# EAGLE design PowerBoard (EAGLE 8.6.3)

## Sheet 1 of 4: Input Voltage
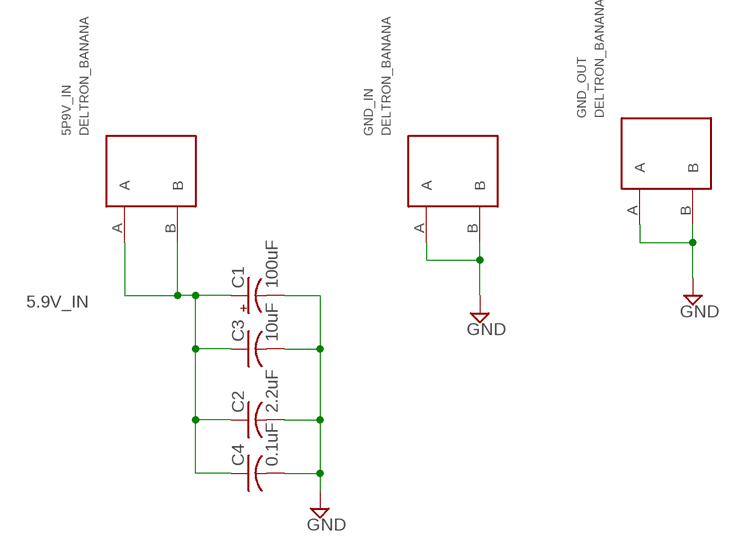
[diagram p0: schematic, sheet 1]

### Parts
5P9V_IN  DELTRON_BANANA  [DELTRON_BANANA]
C1  100uF  CAP_POL_DEV  [CAP_POL_RADIAL_8MM_3P5MMPAD]
C2  2.2uF  C-USC0603  [C0603]
C3  10uF  C-USC1206  [C1206]
C4  0.1uF  C-USC0603  [C0603]
GND_IN  DELTRON_BANANA  [DELTRON_BANANA]
GND_OUT  DELTRON_BANANA  [DELTRON_BANANA]

### Nets
5.9V_IN: 5P9V_IN.A 5P9V_IN.B C1.PIN+ C2.1 C3.1 C4.1 ; also sheet 2,3,4
GND: C1.PIN- C2.2 C3.2 C4.2 GND_IN.A GND_IN.B GND_OUT.A GND_OUT.B ; also sheet 2,3,4

## Sheet 2 of 4: -5V
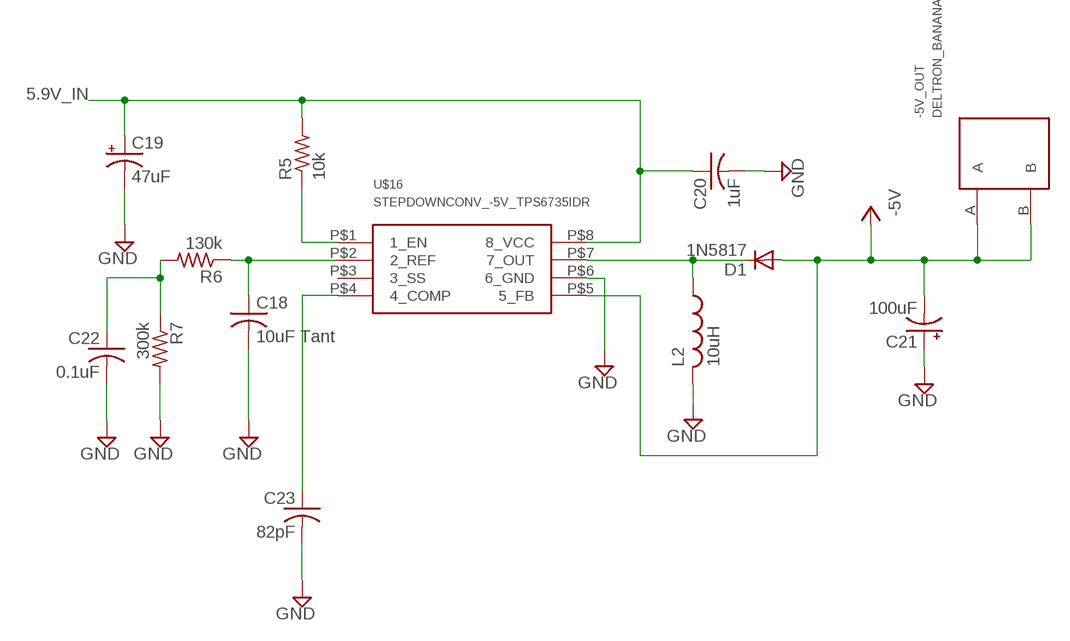
[diagram p1: schematic, sheet 2]

### Parts
-5V_OUT  DELTRON_BANANA  [DELTRON_BANANA]
C18  10uF Tant  C-USC1206  [C1206]
C19  47uF  CPOL-USE5-10.5  [E5-10,5]
C20  1uF  C-USC0603  [C0603]
C21  100uF  CPOL-USE2.5-7  [E2,5-7]
C22  0.1uF  C-USC0603  [C0603]
C23  82pF  C-USC0603  [C0603]
D1  1N5817  DIODE1N4148  [DIODE-1N4148]
L2  10uH  COILCRAFT_10UHIND_DO1608C-103MLB  [COILCRAFT_POWERIND_DO1608C-103MLB]
R5  10k  R-US_R0603  [R0603]
R6  130k  R-US_R0603  [R0603]
R7  300k  R-US_R0603  [R0603]
U$16  STEPDOWNCONV_-5V_TPS6735IDR  [SOIC8]

### Nets
5.9V_IN: C19.+ C20.1 R5.2 U$16.P$8(8_VCC) ; also sheet 1,3,4
-5V: -5V_OUT.A -5V_OUT.B C21.- D1.A U$16.P$5(5_FB)
GND: C18.2 C19.- C20.2 C21.+ C22.2 C23.2 L2.P$2 R7.2 U$16.P$6(6_GND) ; also sheet 1,3,4
N$2: D1.C L2.P$1 U$16.P$7(7_OUT)
N$5: R5.1 U$16.P$1(1_EN)
N$6: C22.1 R6.2 R7.1
N$7: C18.1 R6.1 U$16.P$2(2_REF)
N$8: C23.1 U$16.P$4(4_COMP)
Unconnected: U$16.P$3(3_SS)

## Sheet 3 of 4: 15V
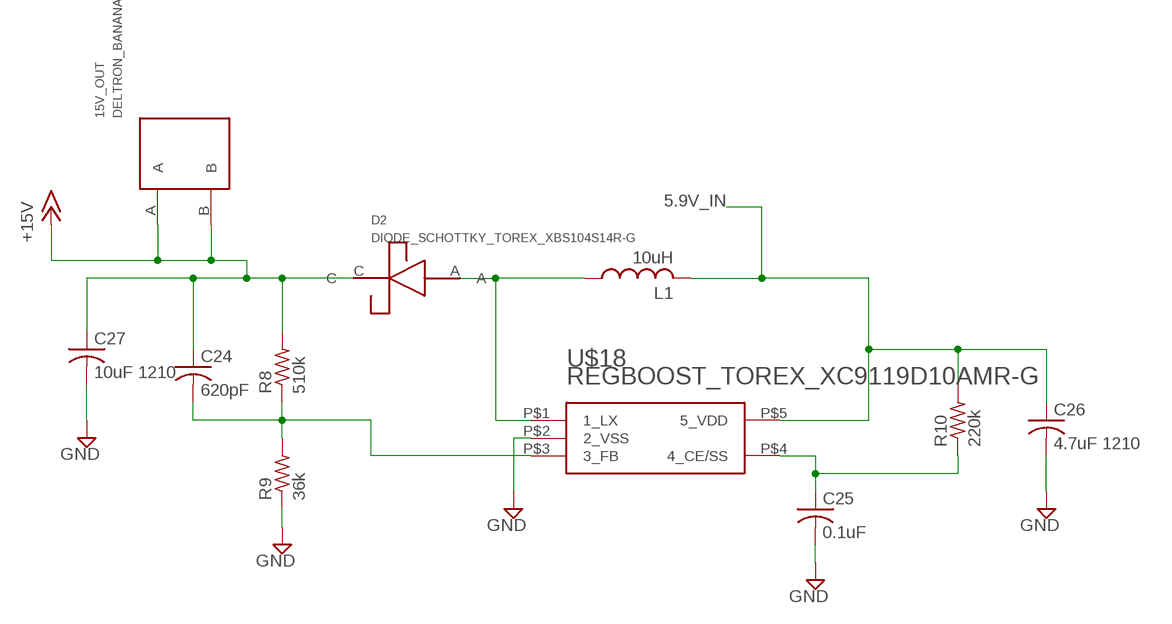
[diagram p2: schematic, sheet 3]

### Parts
15V_OUT  DELTRON_BANANA  [DELTRON_BANANA]
C24  620pF  C-USC0603  [C0603]
C25  0.1uF  C-USC0603  [C0603]
C26  4.7uF 1210  C-USC1210  [C1210]
C27  10uF 1210  C-USC1210  [C1210]
D2  DIODE_SCHOTTKY_TOREX_XBS104S14R-G  [SOD-123A]
L1  10uH  SUMIDA_10UH_IND_CDRH4D18CNP-100PC  [SUMIDA_INDUCTOR_CDRH4D18CNP-100PC]
R8  510k  R-US_R0603  [R0603]
R9  36k  R-US_R0603  [R0603]
R10  220k  R-US_R0603  [R0603]
U$18  REGBOOST_TOREX_XC9119D10AMR-G  [SOT25-5]

### Nets
5.9V_IN: C26.1 L1.P$2 R10.2 U$18.P$5(5_VDD) ; also sheet 1,2,4
+15V: 15V_OUT.A 15V_OUT.B C24.1 C27.1 D2.C R8.2
GND: C25.2 C26.2 C27.2 R9.1 U$18.P$2(2_VSS) ; also sheet 1,2,4
N$10: D2.A L1.P$1 U$18.P$1(1_LX)
N$12: C24.2 R8.1 R9.2 U$18.P$3(3_FB)
N$14: C25.1 R10.1 U$18.P$4(4_CE/SS)

## Sheet 4 of 4: 2.5V
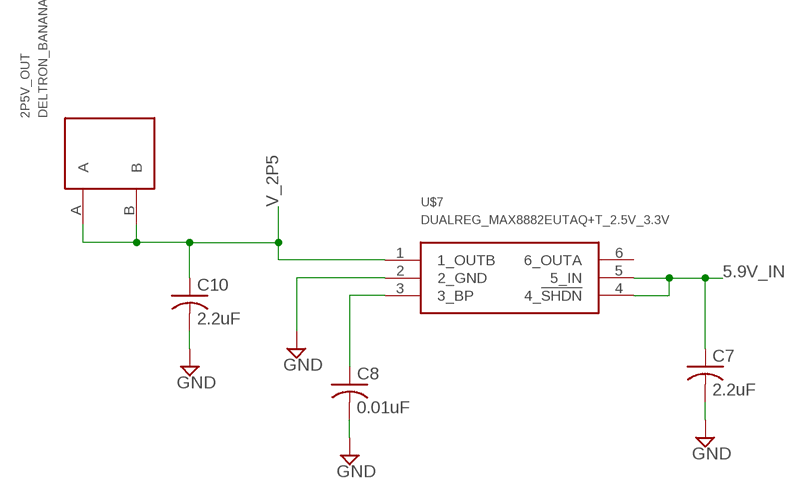
[diagram p3: schematic, sheet 4]

### Parts
2P5V_OUT  DELTRON_BANANA  [DELTRON_BANANA]
C7  2.2uF  C-USC0603  [C0603]
C8  0.01uF  C-USC0603  [C0603]
C10  2.2uF  C-USC0603  [C0603]
U$7  DUALREG_MAX8882EUTAQ+T_2.5V_3.3V  [SOT23-6]

### Nets
5.9V_IN: C7.1 U$7.4(4_!SHDN) U$7.5(5_IN) ; also sheet 1,2,3
GND: C7.2 C8.2 C10.2 U$7.2(2_GND) ; also sheet 1,2,3
N$3: C8.1 U$7.3(3_BP)
V_2P5: 2P5V_OUT.A 2P5V_OUT.B C10.1 U$7.1(1_OUTB)
Unconnected: U$7.6(6_OUTA)

## Library data of the parts
2P5V_OUT 5P9V_IN 15V_OUT -5V_OUT GND_IN GND_OUT = tic_lib_3:DELTRON_BANANA
C1 = RF_servo_SA032212:CAP_POL_DEV: Polarized Capacitor Created on : 03.24.2012 Created by: Serhan Ardanuc
C2-C4 C7 C8 C10 C18 C20 C22-C27 = rcl:C-US: CAPACITOR, American symbol
C19 C21 = rcl:CPOL-US: POLARIZED CAPACITOR, American symbol
D1 = SparkFun:DIODE: Diode These are standard reverse protection diodes and small signal diodes. SMA package can handle up to about 1A. SOD-323 can handle about 200mA. What the SOD-323 package when ordering, there are some mfgs out there that are 5-pin packages.
D2 = fp64v2lib:DIODE_SCHOTTKY_TOREX_XBS104S14R-G: Mouser part no: 865-XBS104S14R-G
L1 = fp64v2lib:SUMIDA_10UH_IND_CDRH4D18CNP-100PC: Digikey Part No: 308-1656-1-ND
L2 = fp64v2lib:COILCRAFT_10UHIND_DO1608C-103MLB: Mouser part no: 994-DO1608C-103MLB
R5-R10 = rcl:R-US_: RESISTOR, American symbol
U$7 = fp64v2lib:DUALREG_MAX8882EUTAQ+T_2.5V_3.3V: Digikey part no: MAX8882EUTAQ+TCT-ND
U$16 = fp64v2lib:STEPDOWNCONV_-5V_TPS6735IDR: Digikey: 296-10982-1-ND
U$18 = fp64v2lib:REGBOOST_TOREX_XC9119D10AMR-G: Digikey Part no: 893-1165-1-ND

## Board
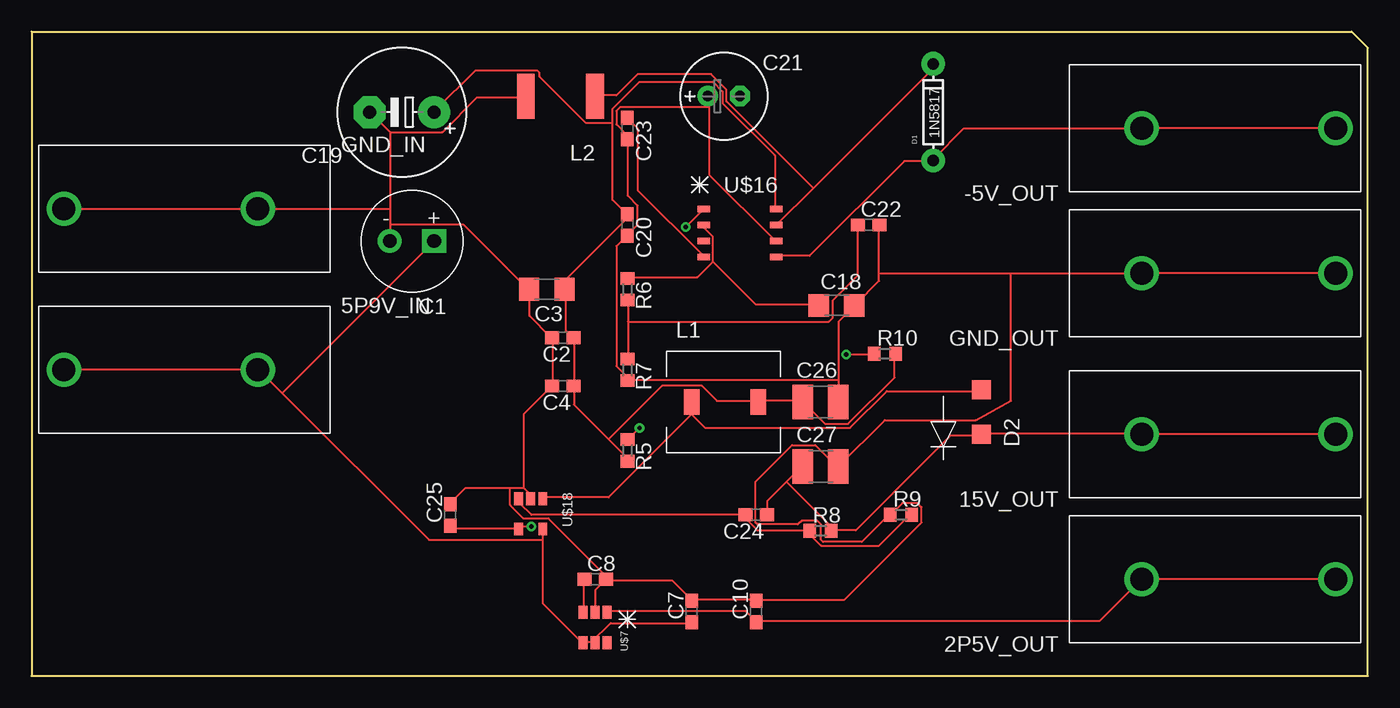
[diagram p4: board, top side]
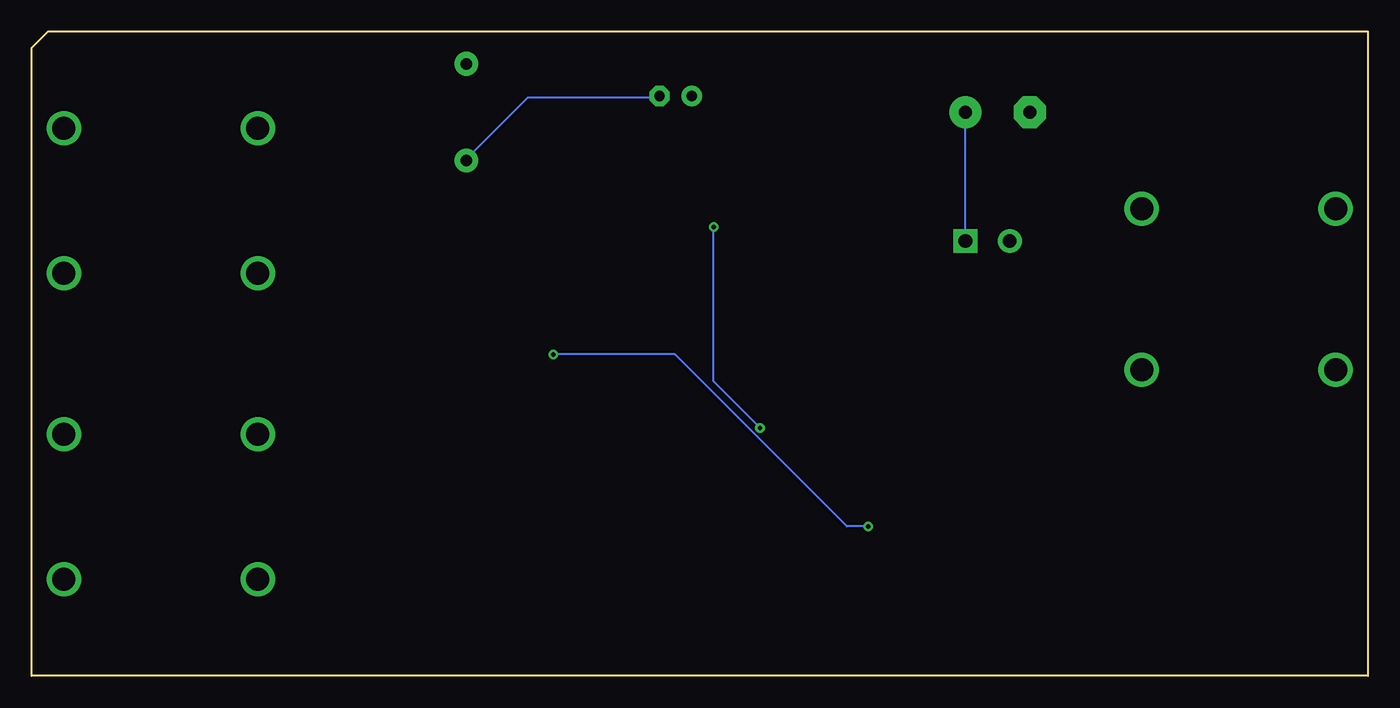
[diagram p5: board, bottom side, seen from below]

Size 105.41 x 50.8 mm. Coordinates in mm from the lower left corner, seen from the top.
Outline: 0,50.8 104.14,50.8 105.41,49.53 105.41,0 0,0 0,50.8
Copper layers (1*16): Top 0.035mm / dielectric 1.5mm / Bottom 0.035mm
Design rules "default": minimum track width 6mil, minimum drill 0.35mm, track to track 6mil, track to pad 6mil, pad to pad 6mil, via to via 6mil, smd to smd 6mil, copper to edge 40mil, drill to drill 6mil, minimum pad ring 10mil, minimum via ring 8mil, stop-mask expansion 4mil, vias tented up to drill 0mil, thermal gap 10mil

### Footprints (pad centres in the part's own frame; a part is rotated, then mirrored left to right if it is on the bottom)
DELTRON_BANANA = drill 1.8: A 0,0; B 15.3,0
CAP_POL_RADIAL_8MM_3P5MMPAD = drill 1.087 pad 1.88 square: PIN+ 0,0 | drill 1.087 pad 1.88: PIN- 3.5,0
C0603 = smd 1.1 x 1: 1 -0.85,0; 2 0.85,0
C1206 = smd 1.6 x 1.8: 1 -1.4,0; 2 1.4,0
E5-10,5 = drill 1.016 pad 2.54: + -2.54,0 | drill 1.016 pad 2.54 octagon: - 2.54,0
E2,5-7 = drill 0.813 pad 1.6: + -1.27,0 | drill 0.813 pad 1.6 octagon: - 1.27,0
C1210 = smd 1.6 x 2.7: 1 -1.4,0; 2 1.4,0
DIODE-1N4148 = drill 0.9 pad 1.88: A -3.81,0; C 3.81,0
SOD-123A = smd 1.5 x 1.5: A 3.5,0; C 0,0
SUMIDA_INDUCTOR_CDRH4D18CNP-100PC = smd 1.25 x 2: P$1 0,0; P$2 5.25,0
COILCRAFT_POWERIND_DO1608C-103MLB = smd 1.397 x 3.556: P$1 0,0; P$2 5.461,0
R0603 = smd 1 x 1.1: 1 -0.85,0; 2 0.85,0
SOT23-6 = smd 0.7 x 1: 1 -0.95,-1.2; 2 0,-1.2; 3 0.95,-1.2; 4 0.95,1.2; 5 0,1.2; 6 -0.95,1.2
SOIC8 = smd 0.991 x 0.508: P$1 -2.87,1.27; P$2 -2.87,0; P$3 -2.87,-1.27; P$4 -2.87,-2.54; P$5 2.87,-2.54; P$6 2.87,-1.27; P$7 2.87,0; P$8 2.87,1.27
SOT25-5 = smd 0.7 x 1: P$1 -0.95,0; P$2 0,0; P$3 0.95,0; P$4 0.95,2.4; P$5 -0.95,2.4

### Placement (x,y rotation side)
2P5V_OUT  102.87,7.62 180 top
5P9V_IN  2.54,24.13 0 top
15V_OUT  102.87,19.05 180 top
-5V_OUT  102.87,43.18 180 top
C1  31.75,34.29 180 top
C2  41.91,26.67 180 top
C3  40.64,30.48 180 top
C4  41.91,22.86 180 top
C7  52.07,5.08 90 top
C8  44.45,7.62 0 top
C10  57.15,5.08 90 top
C18  63.5,29.21 0 top
C19  29.21,44.45 180 top
C20  46.99,35.56 270 top
C21  54.61,45.72 0 top
C22  66.04,35.56 0 top
C23  46.99,43.18 270 top
C24  57.15,12.7 180 top
C25  33.02,12.7 90 top
C26  62.23,21.59 0 top
C27  62.23,16.51 0 top
D1  71.12,44.45 90 top
D2  74.93,19.05 90 top
GND_IN  2.54,36.83 0 top
GND_OUT  102.87,31.75 180 top
L1  52.07,21.59 0 top
L2  44.45,45.72 180 top
R5  46.99,17.78 270 top
R6  46.99,30.48 270 top
R7  46.99,24.13 270 top
R8  62.23,11.43 0 top
R9  68.58,12.7 0 top
R10  67.31,25.4 0 top
U$7  44.45,3.81 180 top
U$16  55.88,35.56 0 top
U$18  39.37,13.97 180 top

### Tracks (layer width: path | path; a pad name or v marks a point on that pad's centre or on a via)
5.9V_IN
  Top 0.152: 45.82,43.64 45.82,37.54 46.89,36.47 C20.1 46.89,36.32 46.89,36.02 42.16,31.29 42.16,30.53 C3.1 42.16,30.38 42.16,27.18 42.62,26.72 C2.1 42.77,26.57 42.77,22.91 C4.1 42.77,22.76 42.77,21.39 45.52,18.64 | 45.82,43.64 45.82,44.7 47.95,46.84 53.75,46.84 54.51,46.08 54.51,45.16 58.62,41.05 58.62,36.93 U$16.P$8 | R10.2 68.07,25.35 68.07,23.52 64.41,19.86 62.59,19.86 60.91,21.54 C26.1 60.76,21.69 57.4,21.69 L1.P$2 57.25,21.69 54.05,21.69 52.83,22.91 49.78,22.91 45.52,18.64 | 45.52,18.64 46.89,17.27 46.89,16.97 R5.2 | 44.14,2.64 44.45,2.64 U$7.5 44.14,2.64 | 44.14,2.64 43.54,2.64 U$7.4 43.38,2.64 40.33,5.69 40.33,10.72 | 40.33,10.72 40.33,11.48 U$18.P$5 | 44.14,2.64 45.67,4.17 52.07,4.17 C7.1 | 5P9V_IN.A 5P9V_IN.B 17.93,24.13 19.76,22.3 | 40.33,10.72 31.34,10.72 19.76,22.3 | 19.76,22.3 C1.PIN+ | 45.82,43.64 43.69,43.64 40.03,47.3 40.03,47.6 39.88,47.75 35,47.75 31.8,44.55 C19.+
  Bottom 0.152: C1.PIN+ 31.8,34.34 31.8,44.4 C19.+
+15V
  Top 0.152: 59.54,15.29 60.76,16.51 C27.1 | 59.54,15.29 58.01,13.77 58.01,12.7 C24.1 | 59.54,15.29 63.04,11.79 63.04,11.48 R8.2 63.2,11.48 65.02,11.48 72.49,18.95 74.93,18.95 D2.C 74.93,19.1 87.43,19.1 15V_OUT.B 87.58,19.1 102.82,19.1 15V_OUT.A
-5V
  Top 0.152: -5V_OUT.A -5V_OUT.B 73.56,43.18 71.12,40.74 D1.A 71.12,40.59 68.83,40.59 61.37,33.12 58.78,33.12 U$16.P$5
  Bottom 0.152: C21.- 55.88,45.62 66.24,45.62 71.12,40.74 D1.A
GND
  Top 0.152: GND_OUT.A GND_OUT.B 77.27,31.75 | 66.85,31.75 66.85,31.14 65.02,29.31 C18.2 64.87,29.16 63.65,27.94 63.65,23.37 | 66.85,31.75 66.85,35.56 C22.2 | 63.65,23.37 63.65,21.69 C26.2 | 53.44,44.86 53.44,45.62 C21.+ | 53.44,44.86 53.44,39.52 58.62,34.34 U$16.P$6 | 53.44,44.86 46.43,44.86 46.13,44.55 46.13,43.48 46.89,42.72 46.89,42.42 C23.2 47.04,42.27 47.04,37.85 47.8,37.08 47.8,35.56 47.04,34.8 C20.2 46.89,34.65 46.13,33.88 46.13,24.44 46.89,23.67 46.89,23.37 R7.2 47.04,23.37 63.65,23.37 | 66.85,31.75 77.27,31.75 | GND_IN.A 2.54,36.78 17.78,36.78 GND_IN.B 17.93,36.78 28.3,36.78 | 28.3,42.88 32.41,42.88 35.15,45.62 38.96,45.62 L2.P$2 | 28.3,42.88 26.77,44.4 C19.- | 28.3,42.88 28.3,36.78 | 28.3,36.78 28.3,35.56 | 28.3,35.56 28.3,34.34 C1.PIN- | 38.81,14.83 39.27,14.38 39.27,14.07 U$18.P$2 | 37.74,14.83 34.24,14.83 33.02,13.61 C25.2 | 37.74,14.83 38.81,14.83 | 38.81,14.83 38.81,20.62 40.95,22.76 C4.2 41.1,22.91 41.1,26.57 C2.2 40.95,26.72 39.27,28.4 39.27,30.38 C3.2 39.12,30.53 34.09,35.56 28.3,35.56 | U$7.2 44.45,6.76 45.21,7.52 C8.2 | 52.07,5.99 57.1,5.99 C10.2 57.25,5.99 64.11,5.99 70.21,12.09 70.21,13.31 69.9,13.61 68.68,13.61 67.77,12.7 R9.1 67.61,12.7 65.48,10.57 62.43,10.57 62.28,10.72 62.28,11.94 61.98,12.24 60.76,12.24 60.45,11.94 57.25,11.94 57.1,12.09 57.1,15.29 60,18.19 61.82,18.19 63.5,16.51 C27.2 63.65,16.51 67.31,20.17 74.47,20.17 77.27,21.69 77.27,31.75 | 52.07,5.99 50.55,7.52 45.36,7.52 C8.2 | 52.07,5.99 C7.2 | 37.74,14.83 37.74,13.46 38.81,12.39 40.79,12.39 45.21,7.98 45.21,7.67 C8.2
N$2
  Top 0.152: 61.67,38.46 71.12,47.9 D1.C | 61.67,38.46 58.78,35.56 U$16.P$7 | 61.67,38.46 54.81,45.31 54.81,46.23 53.59,47.45 47.8,47.45 46.13,45.77 44.45,45.77 L2.P$1
N$3
  Top 0.152: U$7.3 43.54,5.08 43.54,7.52 C8.1
N$5  (via drill 0.35)
  Top 0.152: v51.61,35.41 52.98,36.78 U$16.P$1 | v47.95,19.56 47.04,18.64 R5.1
  Bottom 0.152: v51.61,35.41 51.61,23.22 v47.95,19.56
N$6
  Top 0.152: 47.04,27.94 47.04,29.62 R6.2 | 47.04,27.94 47.04,25.04 R7.1 | 47.04,27.94 62.89,27.94 63.2,28.25 63.2,29.62 65.18,31.6 65.18,35.56 C22.1
N$7
  Top 0.152: 53.75,32.66 53.75,34.65 53.14,35.25 53.14,35.56 U$16.P$2 | 53.75,32.66 52.53,31.45 47.04,31.45 R6.1 | 53.75,32.66 57.1,29.31 61.98,29.31 C18.1
N$8
  Top 0.152: U$16.P$4 52.98,33.12 47.8,38.3 47.8,43.18 47.04,43.94 C23.1
N$10
  Top 0.152: 52.07,20.62 45.52,14.07 40.33,14.07 U$18.P$1 | 52.07,20.62 L1.P$1 52.07,21.54 | 52.07,20.62 53.14,19.56 64.57,19.56 67.46,22.45 74.93,22.45 D2.A
N$12
  Top 0.152: 56.03,12.7 C24.2 56.19,12.7 | 56.03,12.7 39.42,12.7 38.51,13.61 38.51,13.92 U$18.P$3 | 56.03,12.7 57.25,11.48 61.37,11.48 R8.1 61.52,11.33 61.52,11.02 62.28,10.26 66.85,10.26 69.29,12.7 R9.2
N$14  (via drill 0.35)
  Top 0.152: C25.1 33.02,11.79 33.17,11.63 38.35,11.63 U$18.P$4 38.51,11.63 38.66,11.79 v39.42,11.79 | v64.26,25.35 66.4,25.35 R10.1
  Bottom 0.152: v64.26,25.35 54.66,25.35 41.1,11.79 v39.42,11.79
V_2P5
  Top 0.152: U$7.1 45.52,5.08 56.34,5.08 57.1,4.32 C10.1 57.25,4.32 84.23,4.32 87.43,7.52 2P5V_OUT.B 87.58,7.67 102.82,7.67 2P5V_OUT.A